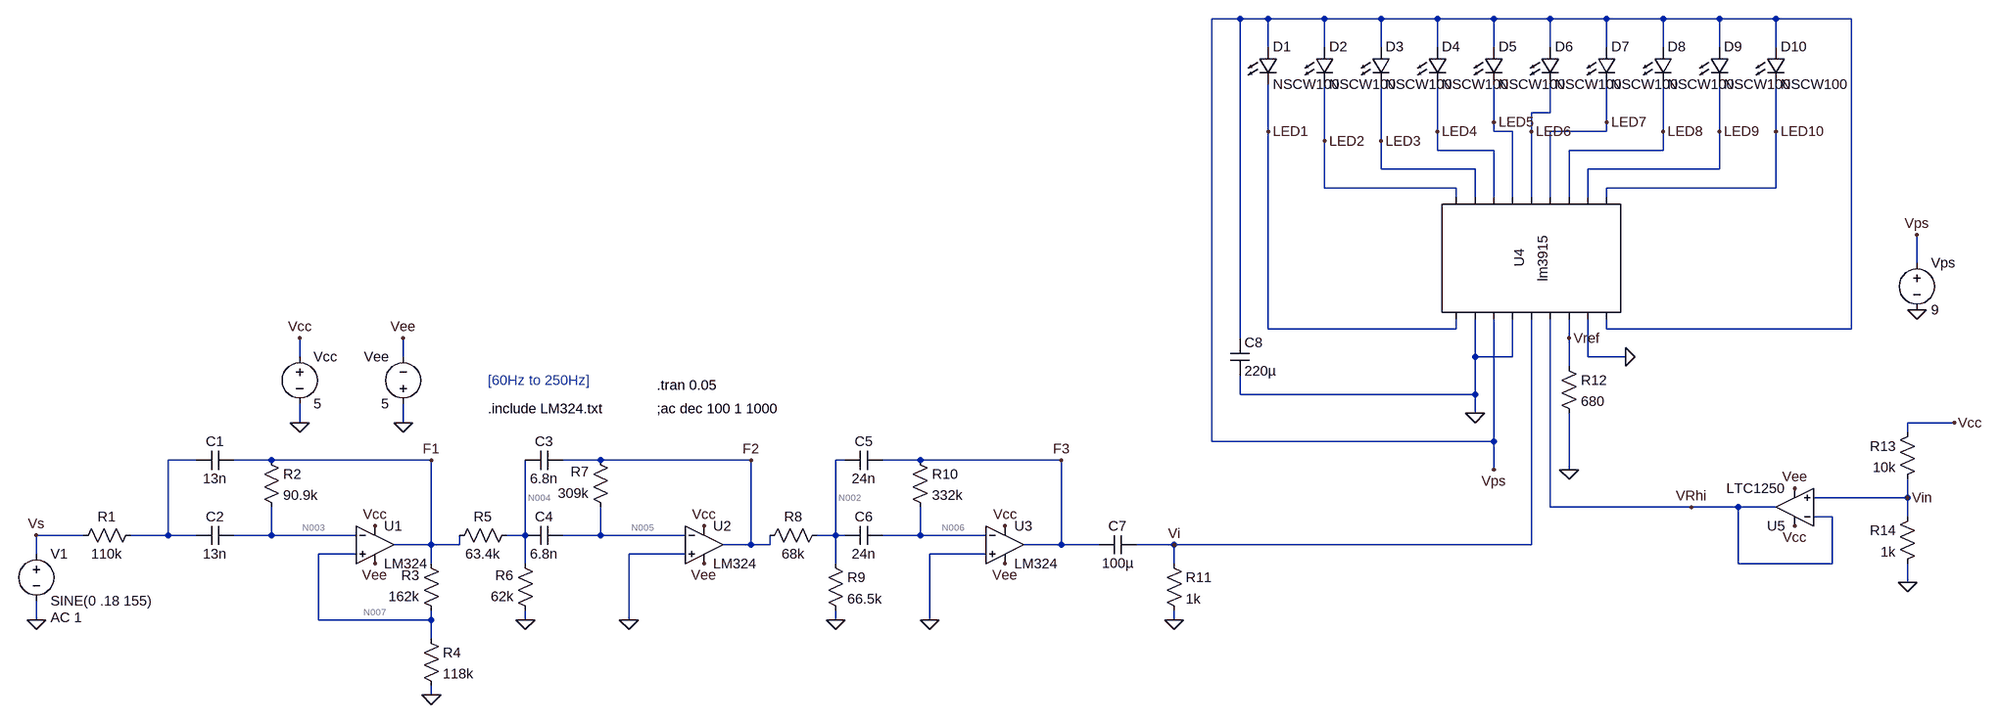
[diagram p0: schematic FinalBassFilterWithLEDDriver.asc]
* FinalBassFilterWithLEDDriver.asc
R1 N001 Vs 110k
V1 Vs 0 SINE(0 .18 155) AC 1
R4 N007 0 118k
R2 F1 N003 90.9k
R5 N004 F1 63.4k
R6 0 N004 62k
R7 N005 F2 309k
R8 F2 N002 68k
R9 N002 0 66.5k
R10 F3 N006 332k
C1 F1 N001 13n
C2 N003 N001 13n
C3 F2 N004 6.8n
C4 N005 N004 6.8n
C5 F3 N002 24n
C6 N006 N002 24n
R3 N007 F1 162k
XU1 N007 N003 Vcc Vee F1 LM324  ; pins In+ In- V+ V- OUT
XU2 0 N005 Vcc Vee F2 LM324  ; pins In+ In- V+ V- OUT
XU3 0 N006 Vcc Vee F3 LM324  ; pins In+ In- V+ V- OUT
Vcc Vcc 0 5
Vee 0 Vee 5
C7 Vi F3 100µ
R11 Vi 0 1k
D1 Vps LED1 NSCW100
D2 Vps LED2 NSCW100
D3 Vps LED3 NSCW100
D4 Vps LED4 NSCW100
D5 Vps LED5 NSCW100
D6 Vps LED6 NSCW100
D7 Vps LED7 NSCW100
D8 Vps LED8 NSCW100
D9 Vps LED9 NSCW100
D10 Vps LED10 NSCW100
C8 Vps 0 220µ
Vps Vps 0 9
* U4: lm3915 (symbol AutoGenerated\lm3915 not available, pins judged from their places): pin1=LED1 pin2=0 pin3=Vps pin4=0 pin5=Vi pin6=VRhi pin7=Vref pin8=0 pin9=Vps pin10=LED2 pin11=LED3 pin12=LED4 pin13=LED5 pin14=LED6 pin15=LED7 pin16=LED8 pin17=LED9 pin18=LED10
R12 Vref 0 680
R13 Vcc Vin 10k
R14 Vin 0 1k
XU5 Vin VRhi Vcc Vee VRhi LTC1250  ; pins In+ In- V+ V- OUT
.model D D
.lib standard.dio
.tran 0.05
;ac dec 100 1 1000
.include LM324.txt
* [60Hz to 250Hz]
.backanno
.end

* Results of the author's LTspice run, read from the files saved beside the schematic
* Operating Point, zero values left out:
*   V(n007) = 1.006 mV
*   V(f1) = -840.3 µV
*   V(n003) = 972.6 µV
*   V(n004) = -415.5 µV
*   V(n005) = -33.59 µV
*   V(f2) = -6.196 mV
*   V(n002) = -3.064 mV
*   V(f3) = -6.655 mV
*   V(n006) = -33.59 µV
*   V(vee) = -5 V
*   V(vcc) = 5 V
*   V(vi) = -25 µV
*   V(vps) = 9 V
*   V(led1) = 7.98 V
*   V(led2) = 7.98 V
*   V(led3) = 7.98 V
*   V(led4) = 7.98 V
*   V(led5) = 7.98 V
*   V(led6) = 7.98 V
*   V(led7) = 7.98 V
*   V(led8) = 7.98 V
*   V(led9) = 7.98 V
*   V(led10) = 7.98 V
*   V(vref) = 1.192 V
*   V(vrhi) = 454.5 mV
*   V(vin) = 454.5 mV
*   I(D10) = 1 µA
*   I(D9) = 1 µA
*   I(D8) = 1 µA
*   I(D7) = 1 µA
*   I(D6) = 1 µA
*   I(D5) = 1 µA
*   I(D4) = 1 µA
*   I(D3) = 1 µA
*   I(D2) = 1 µA
*   I(D1) = 1 µA
*   I(R14) = 454.5 µA
*   I(R13) = 454.5 µA
*   I(R12) = 1.753 mA
*   I(R11) = -25 nA
*   I(R3) = 11.4 nA
*   I(R10) = -19.94 nA
*   I(R9) = -46.07 nA
*   I(R8) = -46.07 nA
*   I(R7) = 19.94 nA
*   I(R6) = 6.701 nA
*   I(R5) = 6.701 nA
*   I(R2) = -19.94 nA
*   I(R4) = 8.528 nA
*   I(Vps) = -10.45 mA
*   I(Vee) = -4.012 mA
*   I(Vcc) = -4.483 mA
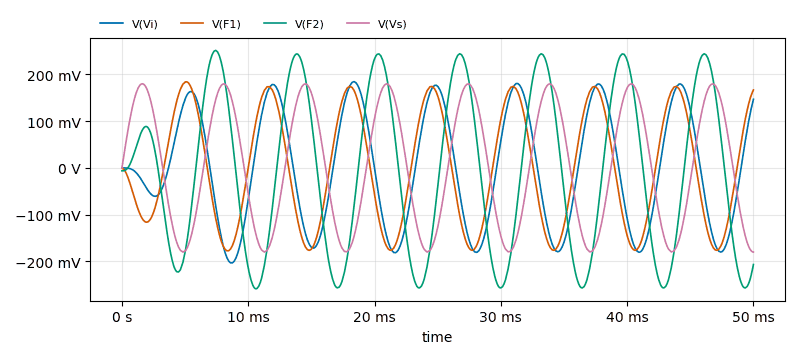
[diagram p1: Transient Analysis of FinalBassFilterWithLEDDriver.asc, plotted from the saved traces]
* Transient Analysis, 1 run:
*   V(Vi): min -203.1 mV, max 184.7 mV, average -2.174 mV, rms 122.3 mV, last 147 mV
*   V(F1): min -177.4 mV, max 184.2 mV, average -1.922 mV, rms 121.6 mV, last 166.9 mV
*   V(F2): min -258.6 mV, max 251.5 mV, average -9.246 mV, rms 172.7 mV, last -206.6 mV
*   V(Vs): min -180 mV, max 180 mV, average 3.727 mV, rms 127.2 mV, last -180 mV